# EAGLE design ArduRCT_Local-v1 (EAGLE 5.07)
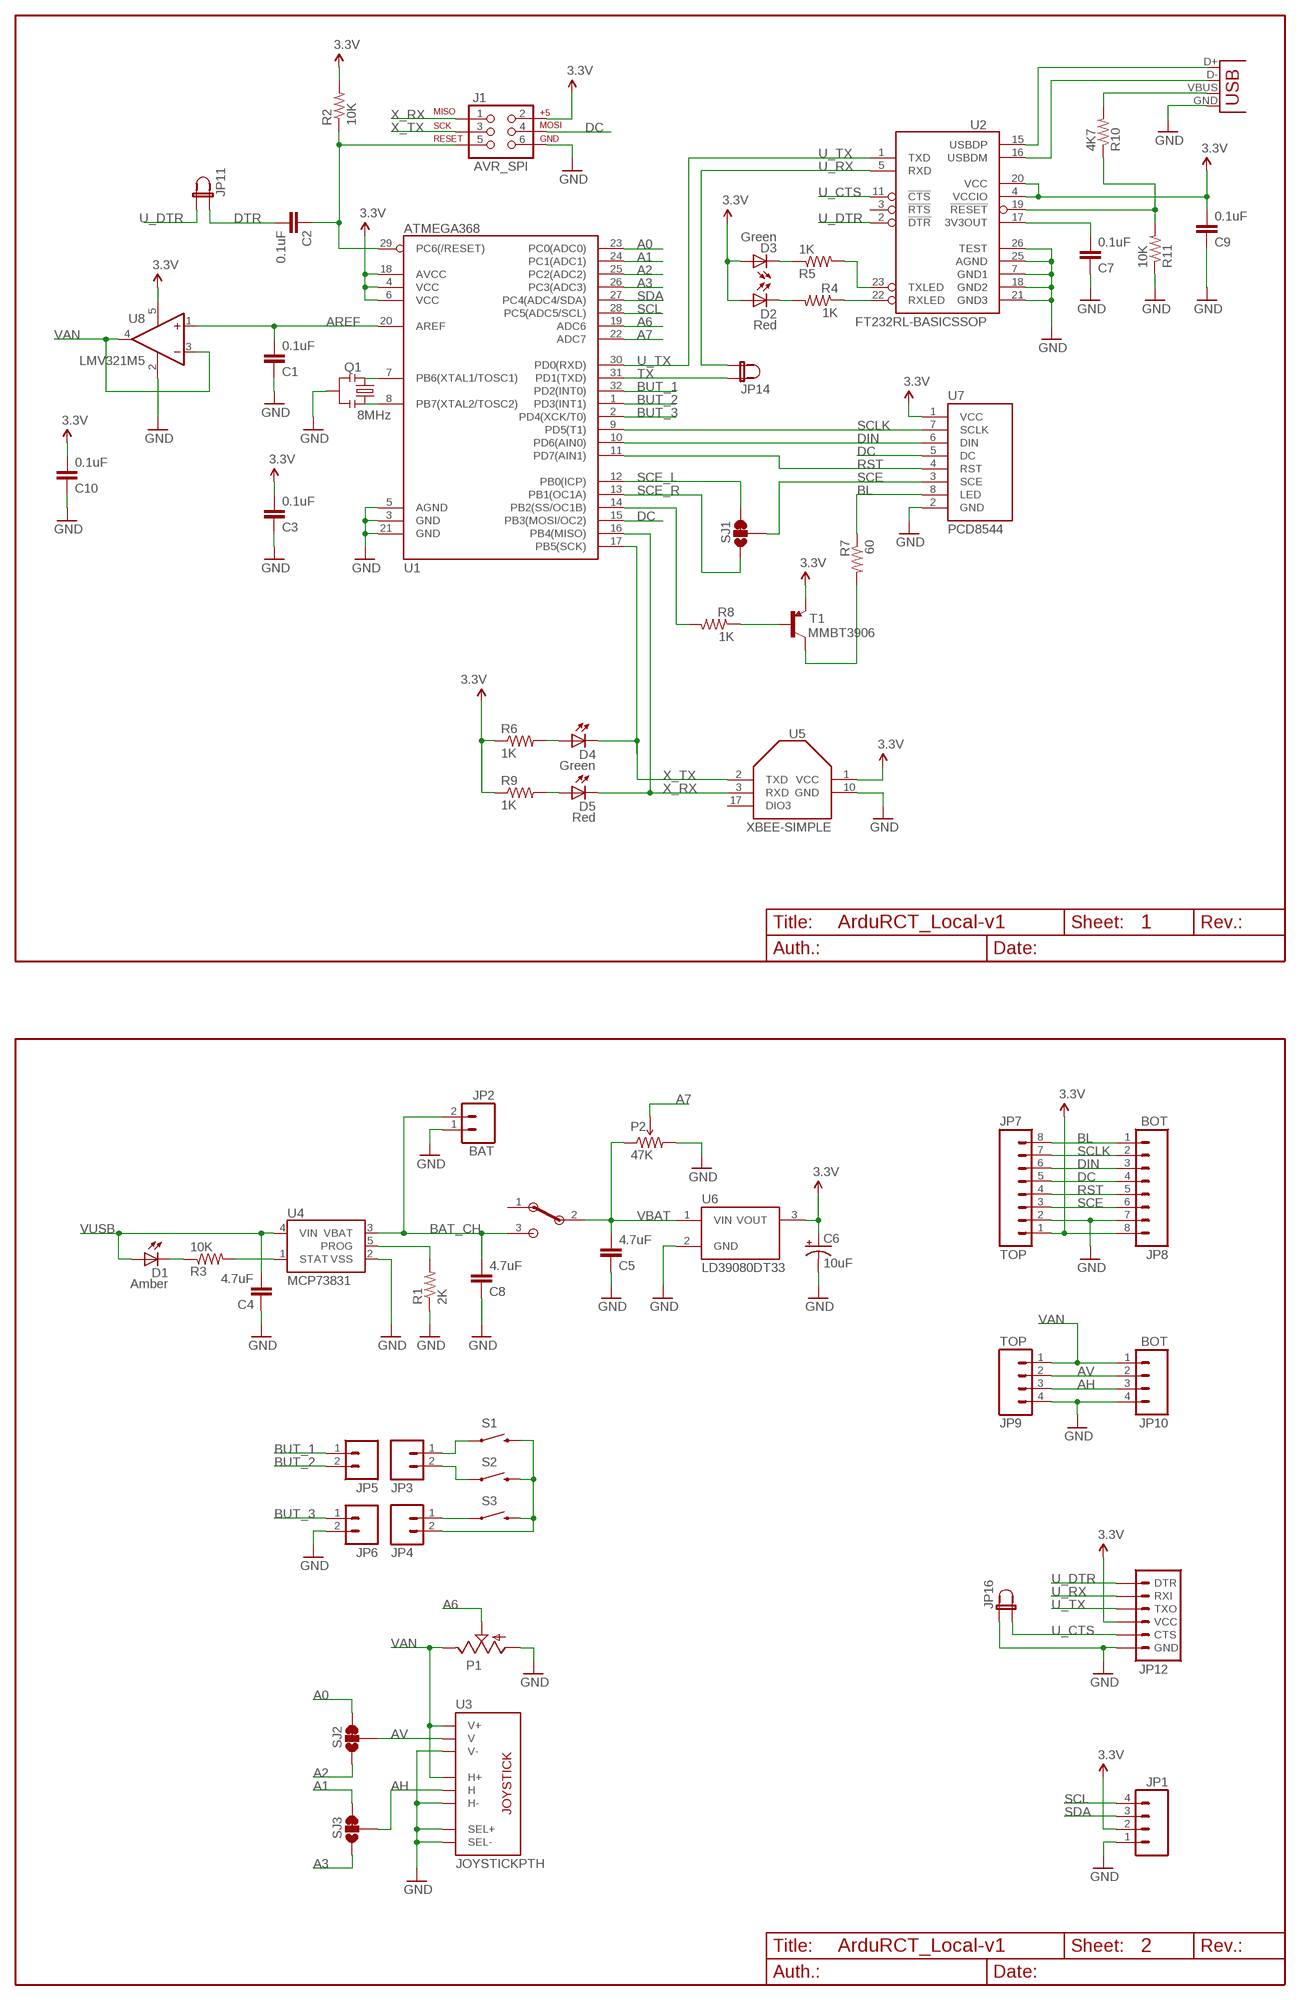
[diagram p0: schematic, sheet 1]

## Parts
C1  0.1uF  CAP0805  [0805]
C2  0.1uF  CAP0805  [0805]
C3  0.1uF  CAP0805  [0805]
C4  4.7uF  CAP0805  [0805]
C5  4.7uF  CAP0805  [0805]
C6  10uF  CAP_POL1206  [EIA3216]
C7  0.1uF  CAP0805  [0805]
C8  4.7uF  CAP0805  [0805]
C9  0.1uF  CAP0805  [0805]
C10  0.1uF  CAP0805  [0805]
D1  Amber  LED  [LED]
D2  Red  LED  [LED]
D3  Green  LED  [LED]
D4  Green  LED  [LED]
D5  Red  LED  [LED]
J1  AVR_SPI  AVR_SPI_PRG_6NS  [2X3-NS]
JP1  M04PTH  [1X04]
JP2  BAT  M02-JST-2MM-SMT  [JST-2-SMD]
JP3  M02PTH  [1X02]
JP4  M02PTH  [1X02]
JP5  M02PTH  [1X02]
JP6  M02PTH  [1X02]
JP7  TOP  M08  [1X8_SMD]
JP8  BOT  M08  [1X8_SMD]
JP9  TOP  M04SMD  [1X4_SMD]
JP10  BOT  M04SMD  [1X4_SMD]
JP11  JP_2_CLOSED  [1X2_CLOSED]
JP12  ARDUINO_SERIAL_PROGRAMPTH  [1X06]
JP14  JP_2_CLOSED  [1X2_CLOSED]
JP16  JP_2_CLOSED  [1X2_CLOSED]
P1  POT  [ALPS_POT]
P2  47K  TRIMPOT-2  [TRIMPOT_TC33]
Q1  8MHz  RESONATORSMD  [RESONATOR-SMD]
R1  2K  RESISTOR0805-RES  [0805]
R2  10K  RESISTOR0805-RES  [0805]
R3  10K  RESISTOR0805-RES  [0805]
R4  1K  RESISTOR0805-RES  [0805]
R5  1K  RESISTOR0805-RES  [0805]
R6  1K  RESISTOR0805-RES  [0805]
R7  60  RESISTOR0805-RES  [0805]
R8  1K  RESISTOR0805-RES  [0805]
R9  1K  RESISTOR0805-RES  [0805]
R10  4K7  RESISTOR0805-RES  [0805]
R11  10K  RESISTOR0805-RES  [0805]
S1  SWITCH-MOMENTARY-2PTH  [TACTILE-PTH]
S2  SWITCH-MOMENTARY-2PTH  [TACTILE-PTH]
S3  SWITCH-MOMENTARY-2PTH  [TACTILE-PTH]
S4  EG1224  [EG1224]
SJ1  SJ_2WAYS_1-2  [SJ_2WAYS_1-2]
SJ2  SJ_2WAYS_1-2  [SJ_2WAYS_1-2]
SJ3  SJ_2WAYS_1-2  [SJ_2WAYS_1-2]
T1  MMBT3906  TRANSISTOR_PNPSMD  [SOT23-3]
U1  ATMEGA368  ATMEGA168  [TQFP32-08]
U2  FT232RL-BASICSSOP  [SSOP28DB]
U3  JOYSTICKPTH  [JOYSTICK]
U4  MCP73831  [SOT23-5]
U5  XBEE-SIMPLE  [XBEE-SMD]
U6  LD39080DT33  [DPAK]
U7  PCD8544  [PCD8544]
U8  LMV321M5  [SOT23-5]
X1  USBSMD  [USB-MINIB]

## Nets
3.3V: C3.2 C6.A(+) C9.2 C10.2 D2.A1(A) D3.A1(A) J1.2 JP1.2 JP7.1 JP8.8 JP12.4(VCC) R2.2 R6.1 R9.1 T1.2(E) U1.4(VCC) U1.6(VCC) U1.18(AVCC) U2.4(VCCIO) U2.20(VCC) U5.1(VCC) U6.3(VOUT) U7.1(VCC) U8.5(V+)
A0: SJ2.1 U1.23(PC0(ADC0))
A1: SJ3.1 U1.24(PC1(ADC1))
A2: SJ2.3 U1.25(PC2(ADC2))
A3: SJ3.3 U1.26(PC3(ADC3))
A6: P1.P$2(S) U1.19(ADC6)
A7: P2.2(WIPER) U1.22(ADC7)
AH: JP9.3 JP10.3 SJ3.2 U3.H2(H)
AREF: C1.2 U1.20(AREF) U8.1(+IN)
AV: JP9.2 JP10.2 SJ2.2 U3.V2(V)
BAT_CH: C8.2 JP2.2 S4.3 U4.3(VBAT)
BL: JP7.8 JP8.1 R7.1 U7.8(LED)
BUT_1: JP5.1 U1.32(PD2(INT0))
BUT_2: JP5.2 U1.1(PD3(INT1))
BUT_3: JP6.1 U1.2(PD4(XCK/T0))
DC: J1.4 JP7.5 JP8.4 U1.15(PB3(MOSI/OC2)) U7.5(DC)
DIN: JP7.6 JP8.3 U1.10(PD6(AIN0)) U7.6(DIN)
DTR: C2.2 JP11.1
GND [vcc]: C1.1 C3.1 C4.1 C5.1 C6.C(-) C7.1 C8.1 C9.1 C10.1 J1.6 JP1.1 JP2.1 JP6.2 JP7.2 JP8.7 JP9.4 JP10.4 JP12.6(GND) JP16.1 P1.P$3(A) P2.3(CW) Q1.2 R1.1 R11.1 U1.3(GND) U1.5(AGND) U1.21(GND) U2.7(GND1) U2.18(GND2) U2.21(GND3) U2.25(AGND) U2.26(TEST) U3.B1A(SEL+) U3.B2A(SEL-) U3.H3(H-) U3.V3(V-) U4.2(VSS) U5.10(GND) U6.2(GND) U7.2(GND) U8.2(V-) X1.GND
N$1: Q1.1 U1.8(PB7(XTAL2/TOSC2))
N$2: Q1.3 U1.7(PB6(XTAL1/TOSC1))
N$3: JP3.1 S1.1
N$4: JP3.2 S2.1
N$5: JP4.1 S3.1
N$6: JP4.2 S1.3 S2.3 S3.3
N$7: R8.2 U1.14(PB2(SS/OC1B))
N$8: D1.C1(C) R3.1
N$9: U2.15(USBDP) X1.D+
N$10: U2.16(USBDM) X1.D-
N$11: R10.1 R11.2 U2.19(!RESET)
N$12: R3.2 U4.1(STAT)
N$13: R1.2 U4.5(PROG)
N$14: D5.A1(A) R9.2
N$17: R7.2 T1.3(C)
N$18: R5.2 U2.23(TXLED)
N$19: C7.2 U2.17(3V3OUT)
N$22: R4.1 U2.22(RXLED)
N$25: D4.A1(A) R6.2
N$27: R8.1 T1.1(B)
RESET: C2.1 J1.5 R2.1 U1.29(PC6(/RESET))
RST: JP7.4 JP8.5 U1.11(PD7(AIN1)) U7.4(RST)
SCE: JP7.3 JP8.6 SJ1.2 U7.3(SCE)
SCE_L: SJ1.1 U1.12(PB0(ICP))
SCE_R: SJ1.3 U1.13(PB1(OC1A))
SCL: JP1.4 U1.28(PC5(ADC5/SCL))
SCLK: JP7.7 JP8.2 U1.9(PD5(T1)) U7.7(SCLK)
SDA: JP1.3 U1.27(PC4(ADC4/SDA))
TX: JP14.1 U1.31(PD1(TXD))
U_CTS: JP12.5(CTS) JP16.2 U2.11(!CTS)
U_DTR: JP11.2 JP12.1(DTR) U2.2(!DTR)
U_RX: JP12.2(RXI) JP14.2 U2.5(RXD)
U_RX_LED: D2.C1(C) R4.2
U_TX: JP12.3(TXO) U1.30(PD0(RXD)) U2.1(TXD)
U_TX_LED: D3.C1(C) R5.1
VAN: JP9.1 JP10.1 P1.P$1(E) U3.H1(H+) U3.V1(V+) U8.3(-IN) U8.4(OUT)
VBAT: C5.2 P2.1(CCW) S4.2 U6.1(VIN)
VUSB: C4.2 D1.A1(A) R10.2 U4.4(VIN) X1.VBUS
X_RX: D5.C1(C) J1.1 U1.16(PB4(MISO)) U5.3(RXD)
X_TX: D4.C1(C) J1.3 U1.17(PB5(SCK)) U5.2(TXD)
Unconnected: S4.1 U2.3(!RTS) U5.17(DIO3)

## Notes on the sheet
- 1
- 2

## Library data of the parts
C1-C5 C7-C10 = SparkFun:CAP: Capacitor Standard 0603 ceramic capacitor, and 0.1" leaded capacitor.
C6 = SparkFun:CAP_POL: Capacitor Polarized These are standard SMD and PTH capacitors. Normally 10uF, 47uF, and 100uF in electrolytic and tantalum varieties. Always verify the external diameter of the through hole cap, it varies with capacity, voltage, and manufacturer. The EIA devices should be standard.
D1-D5 = wibauxl:LED
J1 = SparkFun:AVR_SPI_PRG_6: AVR ISP 6 Pin This is the reduced ISP connector for AVR programming. Common on Arduino. This footprint will take up less PCB space and can be used with a 10-pin to 6-pin adapter such as SKU: BOB-08508
JP1 = SparkFun:M04: Header 4 Standard 4-pin 0.1" header. Use with straight break away headers (SKU : PRT-00116), right angle break away headers (PRT-00553), swiss pins (PRT-00743), machine pins (PRT-00117), and female headers (PRT-00115). Molex polarized connector foot print use with SKU : PRT-08231 with associated crimp pins and housings. 1MM SMD Version SKU: PRT-10208
JP2-JP6 = SparkFun:M02: Header 2 Standard 2-pin 0.1" header. Use with straight break away headers (SKU : PRT-00116), right angle break away headers (PRT-00553), swiss pins (PRT-00743), machine pins (PRT-00117), and female headers (PRT-00115). Molex polarized connector foot print use with SKU : PRT-08233 with associated crimp pins and housings.
JP7 JP8 = wibauxl:M08
JP9 JP10 = wibauxl:M04
JP11 JP14 JP16 = wibauxl:JP_2_CLOSED
JP12 = SparkFun:ARDUINO_SERIAL_PROGRAM
P1 = SparkFun:POT
P2 = SparkFun:TRIMPOT
Q1 = SparkFun:RESONATOR: Resonator Small SMD resonator. This is the itty bitty 10/20MHz resonators with built in caps. CSTCE10M0G55 and CSTCE20M0V53. Footprint has been reviewed closely but hasn't been tested yet.
R1-R11 = SparkFun:RESISTOR: Resistor Basic schematic elements and footprints for 0603, 1206, and PTH resistors.
S1-S3 = SparkFun:SWITCH-MOMENTARY-2
S4 = wibauxl:EG1224
SJ1-SJ3 = wibauxl:SJ_2WAYS_1-2
T1 = wibauxl:TRANSISTOR_PNP: Such as the MMBT3906
U1 = SparkFun:ATMEGA168
U2 = wibauxl:FT232RL-BASIC: USB UART This is the simplified version of the FT232RL unit. Only what you need, nothing you don't. Spark Fun Electronics SKU : COM-00650
U3 = SparkFun:JOYSTICK: Thumb Joystick Joystick commonly found in PS2 controllers. Two pots and a select switch. Footprint proven. Spark Fun Electronics SKU : COM-09032
U4 = SparkFun:MCP73831: Microchip's MCP73831 Miniature single cell, fully integrated Li-Ion, Li-polymer charge management controller http://ww1.microchip.com/downloads/en/DeviceDoc/21984a.pdf
U5 = wibauxl:XBEE-SIMPLE
U6 = wibauxl:LD39080DT33
U7 = wibauxl:PCD8544
U8 = linear:LMV321?*: General Purpose, Low Voltage, Rail-to-Rail Output Operational Amplifiers Source: http://www.national.com/mpf/LM/LMV321.html http://www.national.com/dt/lmv_qual.pdf
X1 = SparkFun:USB: USB Connectors USB-B-PTH is fully proven SKU : PRT-00139 USB-miniB is fully proven SKU : PRT-00587 USB-A-PCB is untested. USB-A-H is throughly reviewed, but untested. Spark Fun Electronics SKU : PRT-00437 USB-B-SMT is throughly reviewed, but untested. Needs silkscreen touching up. USB-A-S has not been used/tested USB-MB-H has not been used/tested

## Net classes
0 default: width 0.203 mm
1 vcc: width 0.254 mm

## Board
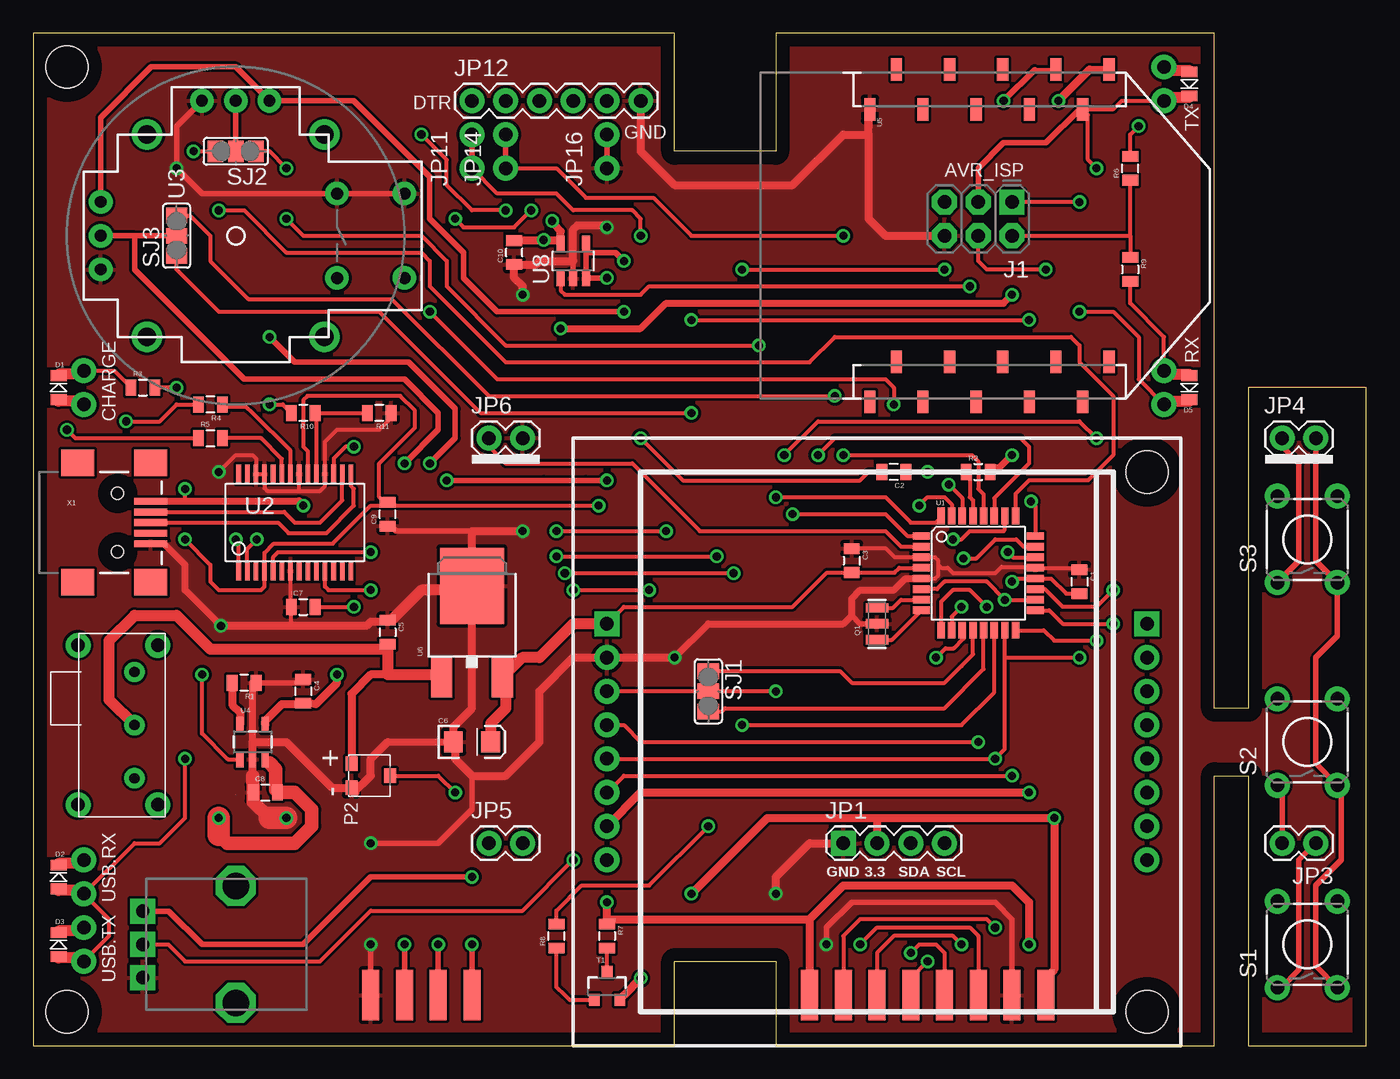
[diagram p1: board, top side]
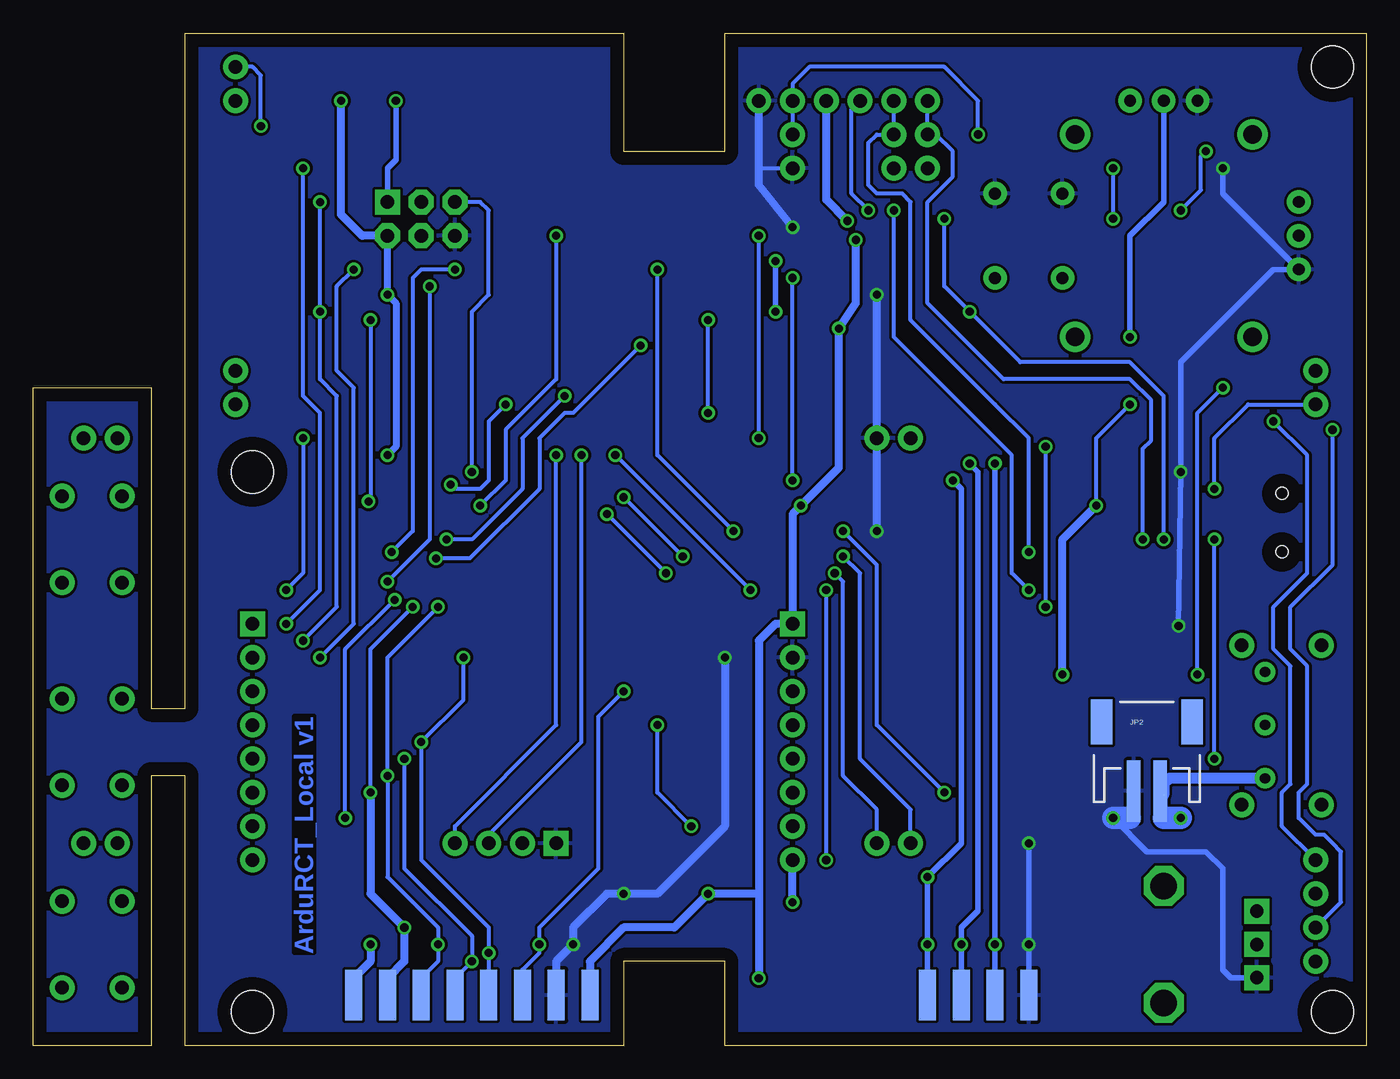
[diagram p2: board, bottom side, seen from below]

Size 100.32 x 76.2 mm. Coordinates in mm from the lower left corner, seen from the top.
Outline: 0,0 48.26,0 48.26,6.35 55.88,6.35 55.88,0 88.9,0 88.9,20.32 91.44,20.32 91.44,0 100.32,0 100.32,49.52 91.44,49.53 91.44,25.4 88.9,25.4 88.9,76.2 55.88,76.2 55.88,67.31 48.26,67.31 48.26,76.19 0,76.19 0,0
Copper layers (1*16): Top 0.035mm / dielectric 1.5mm / Bottom 0.035mm
Design rules "default": minimum track width 10mil, minimum drill 24mil, track to track 8mil, track to pad 8mil, pad to pad 8mil, via to via 8mil, smd to smd 8mil, copper to edge 40mil, drill to drill 8mil, minimum pad ring 10mil, minimum via ring 8mil, stop-mask expansion 4mil, vias tented up to drill 0mil, thermal gap 10mil
Holes 3.2 mm at 2.54,73.66 2.54,2.54

### Footprints (pad centres in the part's own frame; a part is rotated, then mirrored left to right if it is on the bottom)
0805 = smd 0.8 x 1.2: 1 -0.9,0; 2 0.9,0
EIA3216 = smd 1.4 x 1.6: A 1.4,0; C -1.4,0
LED = smd 0.8 x 1.2: A -0.9,0; C 0.9,0 | drill 1.016 pad 1.88 round: A1 -1.27,-1.905; C1 1.27,-1.905
2X3-NS = drill 1.016 pad 1.88 square: 1 -2.54,-1.27 | drill 1.016 pad 1.88 octagon: 2 -2.54,1.27; 3 0,-1.27; 4 0,1.27; 5 2.54,-1.27; 6 2.54,1.27
1X04 = drill 1.016 pad 1.88 square: 1 0,0 | drill 1.016 pad 1.88 round: 2 2.54,0; 3 5.08,0; 4 7.62,0
JST-2-SMD = smd 1 x 4.6: 1 -1,-3.7; 2 1,-3.7 | smd 1.6 x 3.4: NC1 -3.4,1.5; NC2 3.4,1.5
1X02 = drill 1.016 pad 1.88 round: 1 0,0; 2 2.54,0
1X8_SMD = smd 1.27 x 3.81: 1 0,0; 2 2.54,0; 3 5.08,0; 4 7.62,0; 5 10.16,0; 6 12.7,0; 7 15.24,0; 8 17.78,0
1X4_SMD = smd 1.27 x 3.81: 1 0,0; 2 2.54,0; 3 5.08,0; 4 7.62,0
1X2_CLOSED = drill 1.016 pad 1.88 round: 1 -1.27,0; 2 1.27,0
1X06 = drill 1.016 pad 1.88 round: 1 0,0; 2 2.54,0; 3 5.08,0; 4 7.62,0; 5 10.16,0; 6 12.7,0
ALPS_POT = drill 1 pad 1.88 square: P$1 7,-2.5; P$2 7,0; P$3 7,2.5 | drill 2 octagon: P$4 0,-4.4; P$5 0,4.4
TRIMPOT_TC33 = smd 1.1 x 0.9: 1 -0.91,-1.45; 2 0,1.45; 3 0.91,-1.45
RESONATOR-SMD = smd 0.7 x 1.7: 1 -1.2,0; 2 0,0; 3 1.2,0
TACTILE-PTH = drill 1.016 pad 1.88 round: 1 -3.251,2.261; 2 3.251,2.261; 3 -3.251,-2.261; 4 3.251,-2.261
EG1224 = drill 0.762 pad 1.524 round: 1 -4,0; 2 0,0; 3 4,0 | drill 1.016 pad 1.88 round: P$4 6,1.75; P$5 -6,1.75; P$6 -6,-4.25; P$7 6,-4.25
SJ_2WAYS_1-2 = smd 1.168 x 1.6: 1 -1.524,0; 2 0,0; 3 1.524,0
SOT23-3 = smd 0.8 x 0.9: 1 -0.95,-1; 2 0.95,-1; 3 0,1.1
TQFP32-08 = smd 1.27 x 0.559: 1 -4.293,2.8; 2 -4.293,2; 3 -4.293,1.2; 4 -4.293,0.4; 5 -4.293,-0.4; 6 -4.293,-1.2; 7 -4.293,-2; 8 -4.293,-2.8; 17 4.293,-2.8; 18 4.293,-2; 19 4.293,-1.2; 20 4.293,-0.4; 21 4.293,0.4; 22 4.293,1.2; 23 4.293,2; 24 4.293,2.8 | smd 0.559 x 1.27: 9 -2.8,-4.293; 10 -2,-4.293; 11 -1.2,-4.293; 12 -0.4,-4.293; 13 0.4,-4.293; 14 1.2,-4.293; 15 2,-4.293; 16 2.8,-4.293; 25 2.8,4.293; 26 2,4.293; 27 1.2,4.293; 28 0.4,4.293; 29 -0.4,4.293; 30 -1.2,4.293; 31 -2,4.293; 32 -2.8,4.293
SSOP28DB = smd 0.348 x 1.397: 1 -4.225,-3.656; 2 -3.575,-3.656; 3 -2.925,-3.656; 4 -2.275,-3.656; 5 -1.625,-3.656; 6 -0.975,-3.656; 7 -0.325,-3.656; 8 0.325,-3.656; 9 0.975,-3.656; 10 1.625,-3.656; 11 2.275,-3.656; 12 2.925,-3.656; 13 3.575,-3.656; 14 4.225,-3.656; 15 4.225,3.656; 16 3.575,3.656; 17 2.925,3.656; 18 2.275,3.656; 19 1.625,3.656; 20 0.975,3.656; 21 0.325,3.656; 22 -0.325,3.656; 23 -0.975,3.656; 24 -1.625,3.656; 25 -2.275,3.656; 26 -2.925,3.656; 27 -3.575,3.656; 28 -4.225,3.656
JOYSTICK = drill 0.9 pad 1.778 round: B1A -3.175,12.7; B1B 3.175,12.7; B2A -3.175,7.62; B2B 3.175,7.62 | drill 0.889 pad 1.778 round: H1 -2.54,-10.16; H2 0,-10.16; H3 2.54,-10.16; V1 -10.16,2.54; V2 -10.16,0; V3 -10.16,-2.54 | drill 1.397 pad 2.286 round: MOUNT1 -7.62,6.668; MOUNT2 -7.62,-6.668; MOUNT3 7.62,-6.668; MOUNT4 7.62,6.668
SOT23-5 = smd 0.55 x 1.2: 1 -0.95,-1.3; 2 0,-1.3; 3 0.95,-1.3; 4 0.95,1.3; 5 -0.95,1.3
XBEE-SMD = smd 1.7 x 0.85: 1 -12.5,20; 2 -9.5,18; 3 -12.5,16; 4 -9.5,14; 5 -12.5,12; 6 -9.5,10; 7 -12.5,8; 8 -9.5,6; 9 -12.5,4; 10 -9.5,2; 11 12.5,2; 12 9.5,4; 13 12.5,6; 14 9.5,8; 15 12.5,10; 16 9.5,12; 17 12.5,14; 18 9.5,16; 19 12.5,18; 20 9.5,20
DPAK = smd 1.6 x 3: 1 -2.28,-5.31; 3 2.28,-5.31 | smd 4.826 x 5.715: 2 0,1.588
PCD8544 = drill 1.016 pad 1.88 square: 1 -8.89,-19.05; P1 -8.89,21.59 | drill 1.016 pad 1.88 round: 2 -6.35,-19.05; 3 -3.81,-19.05; 4 -1.27,-19.05; 5 1.27,-19.05; 6 3.81,-19.05; 7 6.35,-19.05; 8 8.89,-19.05; P2 -6.35,21.59; P3 -3.81,21.59; P4 -1.27,21.59; P5 1.27,21.59; P6 3.81,21.59; P8 8.89,21.59; P17 6.35,21.59 | hole 3.2: -20.32,21.59; 20.32,21.59
SOT23-5' = smd 0.6 x 1.2: 1 -0.95,-1.306; 2 0,-1.306; 3 0.95,-1.306; 4 0.95,1.306; 5 -0.95,1.306
USB-MINIB = smd 2.5 x 0.5: D+ 2.5,0; D- 2.5,0.8; GND 2.5,-1.6; ID 2.5,-0.8; VBUS 2.5,1.6 | smd 2.5 x 2: MTN1 -3,4.5; MTN2 2.5,4.5; MTN3 -3,-4.5; MTN4 2.5,-4.5 | hole 0.9: 0,2.2; 0,-2.2

### Placement (x,y rotation side)
C1  78.74,34.92 270 top
C2  64.77,43.18 180 top
C3  61.59,36.51 270 top
C4  20.32,26.67 270 top
C5  26.67,31.11 270 top
C6  33.02,22.86 0 top
C7  20.32,33.02 0 top
C8  17.46,19.05 0 top
C9  26.67,40.01 90 top
C10  36.2,59.69 90 top
D1  1.91,49.53 90 top
D2  1.91,12.7 90 top
D3  1.91,7.62 90 top
D4  87,72.39 270 top
D5  87,49.53 270 top
J1  71.12,62.23 180 top
JP1  60.96,15.24 0 top
JP2  16.51,22.86 0 bottom
JP3  96.52,15.24 180 top
JP4  93.98,45.72 0 top
JP5  34.29,15.24 0 top
JP6  34.29,45.72 0 top
JP7  58.42,3.81 180 bottom
JP8  58.42,3.81 0 top
JP9  33.02,3.81 0 bottom
JP10  33.02,3.81 180 top
JP11  33.02,67.31 90 top
JP12  33.02,71.12 0 top
JP14  35.56,67.31 90 top
JP16  43.18,67.31 90 top
P1  15.24,7.62 180 top
P2  25.4,20.32 270 top
Q1  63.5,31.75 90 top
R1  15.88,27.3 180 top
R2  71.12,43.18 0 top
R3  8.26,49.53 0 top
R4  13.34,48.26 180 top
R5  13.34,45.72 0 top
R6  82.55,66.04 90 top
R7  43.18,8.26 270 top
R8  39.37,8.26 90 top
R9  82.55,58.42 270 top
R10  20.32,47.62 180 top
R11  26.04,47.62 180 top
S1  95.89,7.62 90 top
S2  95.89,22.86 90 top
S3  95.89,38.1 90 top
S4  7.62,24.13 270 top
SJ1  50.8,26.67 270 top
SJ2  15.24,67.31 180 top
SJ3  10.79,60.96 90 top
T1  43.18,4.45 0 top
U1  71.12,35.56 0 top
U2  19.68,39.37 0 top
U3  15.24,60.96 270 top
U4  16.51,22.86 0 top
U5  60.96,60.96 270 top
U6  33.02,33.02 0 top
U7  62.23,22.86 270 top
U8  LMV321M5  [SOT23-5']  40.64,59.05 0 top
X1  6.35,39.37 0 top

### Tracks (layer width: path | path; a pad name or v marks a point on that pad's centre or on a via)
3.3V  (via drill 0.61)
  Top 0.305: v42.55,40.64 27.3,40.64 C9.2 26.67,40.64 | D3.A1 5.71,8.26 5.71,9.53 D2.A1 7.62,15.24 9.53,15.24 11.43,17.14 v11.43,21.59 | v11.43,38.1 13.34,36.2 13.34,34.92 13.97,34.29 17.14,34.29 17.41,34.55 U2.4 17.41,37.09 18.1,37.78 22.54,37.78 25.4,40.64 26.67,40.64 | 26.67,40.64 26.04,41.27 26.04,43.81 28.73,46.51 28.73,47.78 27.62,48.9 20.64,48.9 20.32,48.58 20.32,45.09 20.66,44.74 U2.20 | 44.13,3.5 T1.2 | U1.4 65.17,35.96 64.82,35.61 C3.2 59.74,35.61 57.15,33.02 44.45,33.02 U7.1 | U1.18 v73.12,33.56 71.75,34.92 68.58,34.92 68.02,34.36 U1.6 | R2.2 72.66,43.45 72.71,43.5 | 82.55,60.96 R6.1 | J1.2 82.55,60.96 | 82.55,60.96 R9.1
  Top 0.406: U8.5 39.28,60.59
  Top 0.508: 72.66,43.45 72.12,43.45 72.71,43.5 v73.66,44.45 | v39.69,53.98 45.72,53.98 47.62,55.88 73.03,55.88 v73.66,56.52
  Top 0.61: U5.1 79.49,73.46 v77.15,71.12 | 39.28,60.59 C10.2 | v39.05,62.07 39.69,61.28 U8.5 39.69,60.64 v38.42,60.64 | 63.5,17.14 55.24,17.14 v49.53,11.43 | 44.13,3.5 44.45,3.81 v45.72,5.08 | 63.5,17.14 v76.83,17.14 76.83,5.71 76.2,5.08 JP8.8 | 63.5,17.14 JP1.2
  Top 0.813: C6.A 34.42,24.26 35.56,25.4 35.56,27.45 U6.3 36.8,29.21 38.1,29.21 40.64,31.75 U7.1
  Bottom 0.305: v11.43,21.59 v11.43,38.1 | v73.12,33.56 76.83,29.84 v76.83,17.14 | v39.69,53.98 39.37,54.61
  Bottom 0.508: 76.52,61.91 76.83,62.23 | v73.66,44.45 73.03,45.09 73.03,55.88 v73.66,56.52 J1.2
  Bottom 0.61: v39.05,62.07 40.64,63.66 JP12.4 | J1.2 75.56,60.96 76.52,61.91 77.15,62.55 v77.15,71.12 | v38.42,60.64 38.42,55.88 v39.69,53.98 39.69,43.5 v42.55,40.64 43.18,40.01 U7.1 44.45,31.75 45.72,30.48 45.72,11.43 | 45.72,11.43 v45.72,5.08 | 45.72,11.43 v49.53,11.43 52.07,8.89 55.88,8.89 58.42,6.35 JP7.1
A0  (via drill 0.61)
  Top 0.305: SJ2.1 17.78,67.31 v19.05,66.04 | v19.05,62.23 20.32,60.96 29.21,60.96 31.11,59.05 31.11,57.15 35.56,52.7 v54.61,52.7 | U1.23 74.52,37.56 73.98,38.1 72.39,38.1 70.96,36.67 v70.01,36.67
  Bottom 0.305: v19.05,62.23 v19.05,66.04 | v70.01,36.67 67.47,36.67 62.23,41.91 62.23,45.72 60.33,47.62 59.69,47.62 v54.61,52.7
A1  (via drill 0.61)
  Top 0.305: SJ3.1 10.79,58.42 13.97,55.24 26.04,55.24 33.66,47.62 v49.53,47.62 | v75.09,40.96 75.41,40.64 75.41,40.63 U1.24 | v49.53,54.61 v74.93,54.61
  Bottom 0.305: v74.93,54.61 74.93,41.12 v75.09,40.96 | v75.09,40.96 | v49.53,47.62 v49.53,54.61
A2  (via drill 0.61)
  Top 0.305: v12.06,67.31 SJ2.3 | v13.97,62.87 15.88,62.87 19.05,59.69 29.21,59.69 29.84,59.05 29.84,57.15 35.56,51.44 58.42,51.44 60.33,53.34 78.11,53.34 78.74,52.7 78.74,51.44 81.28,48.9 81.28,44.45 79.38,42.55 74.93,42.55 73.92,41.53 U1.25
  Bottom 0.305: v12.06,67.31 12.45,66.93 12.45,64.39 v13.97,62.87
A3  (via drill 0.61)
  Top 0.305: SJ3.3 11.81,62.48 13.34,60.96 13.34,59.05 16.19,56.2 26.99,56.2 34.29,48.9 v60.33,48.9 | U1.26 73.12,38.83 73.03,38.73 70.48,38.73 69.85,38.1 v69.22,38.1
  Bottom 0.305: v69.22,38.1 67.31,38.1 63.5,41.91 63.5,45.72 v60.33,48.9
A6  (via drill 0.61)
  Top 0.305: P1.P$2 10.16,7.62 11.43,6.35 21.59,6.35 25.4,10.16 36.83,10.16 v40.64,13.97 | v40.64,34.29 v46.35,34.29 | U1.19 76.13,34.36 77.47,33.02 80.01,33.02 v81.28,34.29 | v56.52,44.45 59.05,46.99 78.74,46.99 v80.01,45.72
  Bottom 0.305: v40.64,13.97 v40.64,34.29 | v81.28,34.29 80.01,35.56 v80.01,45.72 | v46.35,34.29 v56.52,44.45
A7  (via drill 0.61)
  Top 0.305: P2.2 30.48,20.32 v31.75,19.05 | v39.37,38.73 v47.62,38.73 | U1.22 73.73,36.76 v73.34,37.15 | v53.34,58.42 v68.58,58.42
  Bottom 0.305: v31.75,19.05 36.83,24.13 36.83,36.2 v39.37,38.73 | v73.34,37.15 71.75,38.73 71.75,57.78 71.12,58.42 v68.58,58.42 | v53.34,58.42 53.34,44.45 v47.62,38.73
AH  (via drill 0.61)
  Top 0.406: JP10.3 v27.94,7.62 | 7.62,60.96 U3.H2 | 7.62,60.96 SJ3.2 | v27.94,43.81 30.48,46.35 30.48,47.62 27.94,50.16 15.88,50.16 7.62,58.42 7.62,60.96
  Bottom 0.406: JP10.3 v27.94,7.62 v27.94,43.81
AREF  (via drill 0.61)
  Top 0.305: U8.1 39.69,56.83 40.01,56.52 45.72,56.52 46.35,57.15 v70.48,57.15 | C1.2 77.73,34.02 76.6,35.16 U1.20 73.89,35.16 v73.66,34.92
  Bottom 0.305: v73.66,34.92 70.48,38.1 v70.48,57.15
AV  (via drill 0.61)
  Top 0.406: JP10.2 v30.48,7.62 | U3.V2 SJ2.2 | v29.84,43.81 31.75,45.72 31.75,47.94 28.26,51.44 19.68,51.44 v17.78,53.34
  Bottom 0.406: JP10.2 v30.48,7.62 30.48,8.89 29.21,10.16 29.21,43.18 v29.84,43.81 | v17.78,53.34 17.78,60.96 15.24,63.5 U3.V2
BAT_CH  (via drill 0.61)  (1 unrouted)
  Top 0.406: 17.46,21.27 U4.3
  Top 0.61: C8.2 18.26,19.26 18.73,19.05 | 17.78,21.27 17.46,21.27
  Top 1.016: 18.26,19.26 18.26,20.8 17.78,21.27 | 18.73,19.05 19.68,19.05 20.95,17.78 20.95,16.51 19.68,15.24 14.61,15.24 13.97,15.88
  Top 1.676: v13.97,17.14 13.97,15.88
  Bottom 0.61: 15.24,17.14 15.24,18.89 JP2.2
  Bottom 0.813: S4.3 14.79,20.13 15.24,19.68 15.24,18.86 15.24,19.05
  Bottom 1.676: v13.97,17.14 15.24,17.14
BL  (via drill 0.61)
  Top 0.61: 58.42,9.53 60.96,12.06 73.66,12.06 74.93,10.79 v74.93,7.62 | 58.42,9.53 JP8.1 | R7.1 43.18,9.53 | 43.18,9.53 v43.18,10.79 | 43.18,9.53 58.42,9.53
  Bottom 0.305: 76.2,5.08 JP7.8
  Bottom 0.61: v74.93,7.62 74.93,6.35 76.2,5.08 | v43.18,10.79 U7.8
BUT_1  (via drill 0.61)
  Top 0.305: U1.32 68.32,39.74 67.94,39.37 66.04,39.37 64.14,41.27 v55.88,41.27 | v39.37,36.83 v51.44,36.83
  Bottom 0.305: JP5.1 34.29,17.78 38.1,21.59 38.1,35.56 v39.37,36.83 | v51.44,36.83 v55.88,41.27
BUT_2  (via drill 0.61)
  Top 0.305: U1.1 65.78,38.36 64.14,40.01 v57.15,40.01 | v40.01,35.56 v52.7,35.56
  Bottom 0.305: JP5.2 36.83,17.78 39.37,20.32 39.37,34.92 v40.01,35.56 | v52.7,35.56 v57.15,40.01
BUT_3
  Top 0.305: JP6.1 34.29,45.09 35.56,43.81 45.09,43.81 50.16,38.73 64.14,38.73 65.31,37.56 U1.2
DC  (via drill 0.61)
  Top 0.305: JP8.4 66.04,5.08 v67.31,6.35 | U7.5 v72.39,21.59 73.12,22.32 73.12,29.21 | 73.12,29.21 U1.15 | J1.4 71.12,59.05 71.75,58.42 v76.2,58.42 | 73.12,29.21 v78.74,29.21
  Bottom 0.305: JP7.5 68.58,5.08 v67.31,6.35 67.31,8.26 72.39,13.34 v72.39,21.59 | v78.74,29.21 76.2,31.75 76.2,49.53 77.47,50.8 77.47,57.15 v76.2,58.42
DIN  (via drill 0.61)
  Top 0.305: v69.85,7.62 69.22,8.26 64.77,8.26 63.5,6.99 JP8.3 | U7.6 44.45,20.32 v73.66,20.32 | U1.10 69.12,32.29 v69.85,33.02
  Bottom 0.305: JP7.6 71.12,5.08 69.85,6.35 v69.85,7.62 69.85,8.89 73.66,12.7 v73.66,20.32 73.66,29.21 v69.85,33.02
DTR  (via drill 0.61)
  Top 0.305: JP11.1 34.92,64.14 39.37,64.14 40.64,62.87 45.09,62.87 45.72,62.23 v45.72,60.96 | C2.2 62.87,43.18 62.23,42.55 48.9,42.55 v45.72,45.72
  Bottom 0.305: v45.72,45.72 v45.72,60.96
GND  (via drill 0.61)
  Top 0.305: 20,41.75 17.62,41.75 17.41,41.96 U2.25 U2.26 16.76,44.2 16.51,44.45 15.24,44.45 v13.97,43.18 | 20,41.75 20.01,42.23 U2.21 20,41.75 | U2.7 19.36,33.08 C7.1 19.42,31.86 19.68,31.59 | 20,41.75 21.59,41.75 21.96,42.12 U2.18 21.96,45.45 22.86,46.35 26.04,46.35 26.67,46.99 26.67,47.36 R11.1 | C1.1 78.61,35.96 U1.21 75.25,35.88 75.09,36.04 72.87,36.04 72.39,35.56 69.22,35.56 68.81,35.96 68.34,35.96 68.1,36.2 | C3.1 64.19,37.41 64.84,36.76 U1.3 67.86,36.76 68.1,36.51 68.1,36.2 | U1.5 67.86,35.16 68.1,35.4 68.1,36.2 | v48.26,29.21 45.72,29.21
  Top 0.406: v25.4,7.62 JP10.4 | 62.94,70.48 U5.10 | 40.64,59.05 U8.2 | C8.1 16.56,19.16 | 16.77,27.57 R1.1 20.69,27.3 C4.1 | 33.02,20.32 33.02,17.78 30.48,15.24 v25.4,15.24 | C6.C 31.75,22.73 | U3.V3 10.79,69.22 v10.79,66.04 12.7,64.14 U3.B2A U3.B1A | C9.1 26.93,39.1 27.3,38.73 33.02,38.73 | Q1.2 62.23,31.75 61.59,32.38 | JP8.7 73.66,9.53 72.39,10.79 61.59,10.79 59.69,8.89 v59.69,7.62
  Top 0.508: 16.77,27.57 16.51,27.3 16.51,22.86 | 26.67,22.86 C6.C | X1.GND 9.86,37.77 11.43,36.2 11.43,34.29 v14.13,31.59 | U1.5 65.64,35.16 64.77,34.29 62.23,34.29 61.59,33.66 61.59,32.38 60.96,31.75 50.8,31.75 v48.26,29.21 | U7.2 43.81,29.21
  Top 0.61: 62.87,68.58 60.96,68.58 57.15,64.77 48.26,64.77 45.72,67.31 JP12.6 | 62.87,68.58 62.94,70.48 | 16.51,20.32 U4.2 16.51,22.86 19.05,22.86 22.5,19.41 P2.3 24.23,19.05 24.13,19.05 25.4,20.32 25.4,21.59 26.67,22.86 | C6.C 31.62,24 33.02,25.4 U6.2 33.02,38.73 v36.83,38.73 | 31.75,22.73 31.75,21.59 33.02,20.32 35.56,20.32 38.1,22.86 38.1,26.67 40.64,29.21 U7.2 | v43.18,61.59 42.86,61.75 40.96,61.75 40.64,61.44 40.64,59.05 38.1,59.05 37.84,58.79 C10.1 36.2,57.78 36.83,57.15 v36.83,56.52 | v14.13,31.59 18.89,31.59 19.53,31.59 19.68,31.59 20.16,31.59 25.08,31.59 25.4,31.91 26.56,31.91 C5.1 | C7.1 19.53,32.91 | U5.10 62.87,70.46 62.87,68.58 | 62.87,68.58 62.87,62.23 64.14,60.96 J1.6 | 43.81,29.21 v48.26,29.21 | JP1.1 58.42,15.24 55.88,12.7 v55.88,11.43
  Top 0.813: C5.1 26.93,32.02 29.21,34.29 32.7,34.29 U6.2
  Top 1.016: 16.56,19.16 16.51,20.32 | C8.1 16.56,18.36 17.78,17.14
  Top 1.676: v19.05,17.14 17.78,17.14
  Bottom 0.305: 45.72,66.04 JP16.1
  Bottom 0.406: JP10.4 v25.4,7.62 v25.4,15.24 | P1.P$3 10.2,5.12 10.79,5.71 10.79,13.34 12.06,14.61 16.51,14.61 v19.05,17.14 | v14.13,31.59 v13.97,43.18 13.97,51.44 6.99,58.42 U3.H3 10.79,64.14 v10.79,66.04
  Bottom 0.61: v36.83,56.52 JP6.2 v36.83,38.73 | v48.26,29.21 48.26,16.51 53.34,11.43 v55.88,11.43 57.15,11.43 59.69,8.89 v59.69,7.62 60.96,6.35 JP7.2 | 17.78,17.14 17.51,17.41 JP2.1 | v43.18,61.59 45.72,64.77 45.72,66.04 JP12.6
  Bottom 1.676: v19.05,17.14 17.78,17.14
  pour Top: 0,76.2 100.33,76.2 100.33,0 0,0
  pour Bottom: 0,76.2 100.33,76.2 100.33,0 0,0
N$1
  Top 0.305: Q1.1 64.62,30.55 U1.8
N$2
  Top 0.305: 63.57,33.02 Q1.3 64.7,32.95 65.31,33.56 U1.7
N$3
  Top 0.406: S1.1 93.94,4.41 95.25,5.71 95.25,13.97 JP3.1
N$4
  Top 0.406: JP3.2 93.98,19.33 S2.1
N$5
  Top 0.406: JP4.1 93.98,45.09 95.25,43.81 95.25,36.47 S3.1
N$6
  Top 0.305: 98.15,19.33 S2.3
  Top 0.406: S2.3 96.52,21.23 96.52,29.21 98.15,30.84 S3.3 96.52,36.47 JP4.2 | 98.15,19.33 98.42,19.05 98.42,13.97 96.52,12.06 96.52,5.99 S1.3
N$7  (via drill 0.61)
  Top 0.305: R8.2 39.37,10.16 41.27,12.06 46.35,12.06 v50.8,16.51 | U1.14 72.32,26.6 69.85,24.13 v53.34,24.13
  Bottom 0.305: v50.8,16.51 53.34,19.05 v53.34,24.13
N$8
  Top 0.305: D1.C1 6.08,50.8 R3.1
N$9
  Top 0.305: X1.D+ 18.41,39.37 19.21,38.58 22.07,38.58 24.13,40.64 24.13,41.91 23.91,42.13 U2.15
N$10
  Top 0.305: X1.D- 18.89,40.17 19.68,39.37 21.59,39.37 23.26,41.04 U2.16
N$11
  Top 0.305: R11.2 R10.1 21.31,47.53 U2.19
N$12  (via drill 0.61)
  Top 0.305: U4.1 14.63,21.56 12.7,23.5 v12.7,27.94 | v10.79,49.53 R3.2
  Bottom 0.305: v12.7,27.94 12.7,47.62 v10.79,49.53
N$13
  Top 0.61: U4.5 15.56,25.08 14.97,25.66 R1.2
N$14
  Top 0.305: R9.2 82.55,55.88 85.09,53.34 D5.A1
N$17
  Top 0.305: 43.18,5.71 T1.3 R7.2
N$18
  Top 0.305: U2.23 18.71,44.16 17.14,45.72 R5.2
N$19  (via drill 0.61)
  Top 0.305: U2.17 22.61,44.2 23.5,45.09 v24.13,45.09 | C7.2 v24.13,33.02
  Bottom 0.305: v24.13,33.02 v24.13,45.09
N$22
  Top 0.305: U2.22 19.36,44.77 16.51,47.62 16.03,48.05 14.18,48.05 13.97,48.26 R4.1
N$25  (via drill 0.61)
  Top 0.305: R6.2 82.55,68.58 v83.19,69.22
  Bottom 0.305: v83.19,69.22 83.19,73.03 83.82,73.66 D4.A1
N$27
  Top 0.305: R8.1 39.37,4.4 40.01,3.81 40.37,3.44 T1.1
RESET  (via drill 0.61)
  Top 0.305: C2.1 v67.31,43.18 R2.1 70.48,42.91 70.48,41.27 70.72,41.04 U1.29
  Bottom 0.305: J1.5 66.67,63.5 66.04,62.87 66.04,56.52 67.31,55.24 v67.31,43.18
RST  (via drill 0.61)
  Top 0.305: JP8.5 68.58,6.99 67.94,7.62 66.67,7.62 v66.04,6.99 | U7.4 44.45,24.13 45.72,22.86 v71.12,22.86 | U1.11 70.01,30.64 69.28,29.91 68.65,29.91 v67.94,29.21
  Bottom 0.305: JP7.4 v66.04,6.99 66.04,8.89 71.12,13.97 v71.12,22.86 67.94,26.04 v67.94,29.21
SCE  (via drill 0.61)
  Top 0.305: JP8.6 71.12,8.26 70.48,8.89 63.5,8.89 v62.23,7.62 | U7.3 SJ1.2 v55.88,26.67
  Bottom 0.305: JP7.3 63.5,5.71 62.23,6.99 v62.23,7.62 62.23,8.89 57.78,13.34 57.78,24.77 v55.88,26.67
SCE_L
  Top 0.305: U1.12 70.72,29.45 69.85,28.57 68.58,27.3 61.59,27.3 60.71,28.19 SJ1.1
SCE_R
  Top 0.305: U1.13 71.52,28.34 68.58,25.4 52.07,25.4 51.82,25.15 SJ1.3
SCL  (via drill 0.61)
  Top 0.305: v60.96,44.45 70.64,44.45 71.12,43.97 71.12,41.91 71.52,41.51 U1.28
  Bottom 0.305: v60.96,44.45 60.96,24.13 68.58,16.51 JP1.4
SCLK  (via drill 0.61)
  Top 0.305: JP8.2 60.96,8.26 62.23,9.53 71.75,9.53 v72.39,8.89 | U1.9 68.32,33.4 69.22,34.29 70.48,34.29 v71.75,33.02
  Top 0.61: v74.93,19.05 45.72,19.05 U7.7
  Bottom 0.305: 73.66,5.08 JP7.7 | v71.75,33.02 74.93,29.84 v74.93,19.05
  Bottom 0.61: 73.66,5.08 72.39,6.35 v72.39,8.89 74.93,11.43 v74.93,19.05
SDA  (via drill 0.61)
  Top 0.305: U1.27 72.32,41.2 74.93,43.81 74.93,45.09 74.3,45.72 60.33,45.72 v59.05,44.45
  Bottom 0.305: v59.05,44.45 59.05,22.86 66.04,15.88 JP1.3
TX  (via drill 0.61)
  Top 0.305: JP14.1 39.37,66.04 41.59,63.82 46.67,63.82 49.53,60.96 v60.96,60.96 | U1.31 69.12,40.73 68.58,41.27 67.31,41.27 v66.67,40.64
  Bottom 0.305: v66.67,40.64 64.77,42.55 64.77,46.35 60.96,50.16 v60.96,60.96
U_CTS  (via drill 0.61)
  Top 0.305: U2.11 21.96,34.55 22.23,34.29 v25.4,34.29 | v29.21,68.58 31.11,66.67 31.11,64.77 33.02,62.87 v35.56,62.87
  Bottom 0.305: v25.4,34.29 26.67,35.56 26.67,44.45 35.56,53.34 v35.56,62.87 | v29.21,68.58 29.21,71.12 31.75,73.66 41.91,73.66 43.18,72.39 JP12.5 JP16.2
U_DTR  (via drill 0.61)
  Top 0.305: U2.2 16.11,37.38 v16.83,38.1
  Bottom 0.305: v16.83,38.1 16.83,44.93 16.19,45.56 16.19,48.58 17.78,50.16 27.3,50.16 30.96,53.82 | 30.96,53.82 | 30.96,53.82 33.02,55.88 33.02,63.5 31.11,65.41 31.11,67.31 32.38,68.58 JP11.2 JP12.1
U_RX  (via drill 0.61)
  Top 0.305: U2.5 18.06,36.79 18.41,37.15 v25.4,37.15
  Bottom 0.305: v25.4,37.15 25.4,45.72 27.94,48.26 33.5,53.82 34.29,54.61 34.29,63.5 34.92,64.14 36.83,64.14 37.47,64.77 37.47,67.94 36.83,68.58 JP14.2 JP12.2
U_RX_LED  (via drill 0.61)
  Top 0.305: v6.99,46.99 9.53,46.99 10.79,48.26 R4.2
  Bottom 0.305: D2.C1 6.35,16.51 6.35,19.05 5.71,19.68 5.71,28.57 6.99,29.84 6.99,33.02 4.45,35.56 4.45,44.45 v6.99,46.99
U_TX  (via drill 0.61)
  Top 0.305: U2.1 15.46,37.88 v15.24,38.1 | v31.75,62.23 32.38,61.59 36.2,61.59 v37.47,62.87 | v29.84,55.24 34.92,50.16 64.14,50.16 64.77,49.53 v64.77,48.26 | U1.30 69.92,41.2 v68.9,42.23
  Bottom 0.305: v15.24,38.1 15.24,48.9 17.78,51.44 26.04,51.44 v29.84,55.24 31.75,57.15 v31.75,62.23 | v37.47,62.87 38.73,64.14 38.73,70.48 JP12.3 | v68.9,42.23 68.58,41.91 66.67,41.91 66.04,42.55 66.04,46.99 v64.77,48.26
U_TX_LED  (via drill 0.61)
  Top 0.305: R5.1 3.17,45.72 v2.54,46.35
  Bottom 0.305: D3.C1 1.91,10.79 1.91,14.61 2.54,15.24 3.17,15.88 3.81,15.88 5.08,17.14 5.08,19.05 4.45,19.68 4.45,28.57 5.71,29.84 5.71,33.02 2.54,36.2 v2.54,46.35
VAN  (via drill 0.61)
  Top 0.305: U8.3 41.63,57.78
  Top 0.406: v33.02,7.62 JP10.1 | P1.P$1 10.2,10.12 12.7,7.62 20.32,7.62 25.4,12.7 v33.02,12.7 | U3.H1 5.08,69.85 8.89,73.66 15.24,73.66 U3.V1 24.13,71.12 29.84,65.41 29.84,62.23 32.38,59.69 32.38,57.78 34.92,55.24 v44.45,55.24 | 41.59,58.1 U8.4 41.63,59.69 43.81,59.69 v44.45,59.05 | v43.18,42.55 41.59,42.54 38.42,42.55 v31.11,42.55 | v43.18,57.78 41.91,57.78 41.59,58.1 | 41.59,58.1 U8.3
  Bottom 0.305: v43.18,42.55 v43.18,57.78
  Bottom 0.406: JP10.1 v33.02,7.62 v33.02,12.7 30.48,15.24 30.48,41.91 v31.11,42.55 | v44.45,59.05 v44.45,55.24
VBAT
  Top 0.61: P2.1 23.95,26.49 25.4,27.94 26.67,27.94 | 30.51,27.94 U6.1
  Top 0.813: 30.51,27.94 26.67,27.94 C5.2 26.41,29.84 13.34,29.84 10.79,32.38 7.62,32.38 5.71,30.48 5.71,26.04 S4.2
VUSB  (via drill 0.61)
  Top 0.305: 11.43,40.97 v11.43,41.91 | v17.78,48.26 18.79,48.26 R10.2
  Top 0.508: 20,40.96 11.43,40.97 X1.VBUS
  Top 0.61: U4.4 17.46,24.45 18.73,25.72 20.27,25.72 C4.2 20.32,25.88 21.27,25.72 22.86,27.3 v22.86,27.94 | v20.32,40.64 20,40.96
  Bottom 0.305: D1.A1 8.89,48.26 11.43,45.72 v11.43,41.91 | v17.78,48.26 20.32,45.72 v20.32,40.64
  Bottom 0.508: 20.47,40.49 v20.32,40.64
  Bottom 0.61: 20.47,40.49 22.86,38.1 v22.86,27.94
X_RX  (via drill 0.61)
  Top 0.305: v80.01,30.48 76.83,30.48 76.05,31.27 U1.16 | v78.74,63.5 J1.1 | D5.C1 83.19,50.16 83.19,53.34 81.28,55.24 v78.74,55.24 | 75.36,73.46 U5.3
  Top 0.406: v73.03,71.12 75.36,73.46
  Bottom 0.305: v80.01,30.48 77.47,33.02 77.47,48.9 78.74,50.16 v78.74,55.24 v78.74,63.5
  Bottom 0.406: v73.03,71.12 73.03,66.67 73.66,66.04 J1.1
X_TX  (via drill 0.61)
  Top 0.305: D4.C1 81.92,71.12 81.28,70.48 78.98,70.48 | U1.17 76.46,32.76 77.47,31.75 v81.28,31.75 | v80.01,66.04 79.38,66.67 79.38,70.05 U5.2
  Top 0.406: 78.98,70.48 U5.2 78.72,70.46 76.2,67.94 73.03,67.94 71.12,66.04 J1.3
  Bottom 0.305: v81.28,31.75 78.74,34.29 78.74,47.62 80.01,48.9 v80.01,66.04

### Text on the board
Bottom: ArduRCT_Local v1
tPlace: TX | DTR | GND | AVR_ISP | RX | CHARGE | + | - | GND | 3.3 | SDA | SCL | USB.RX | USB.TX